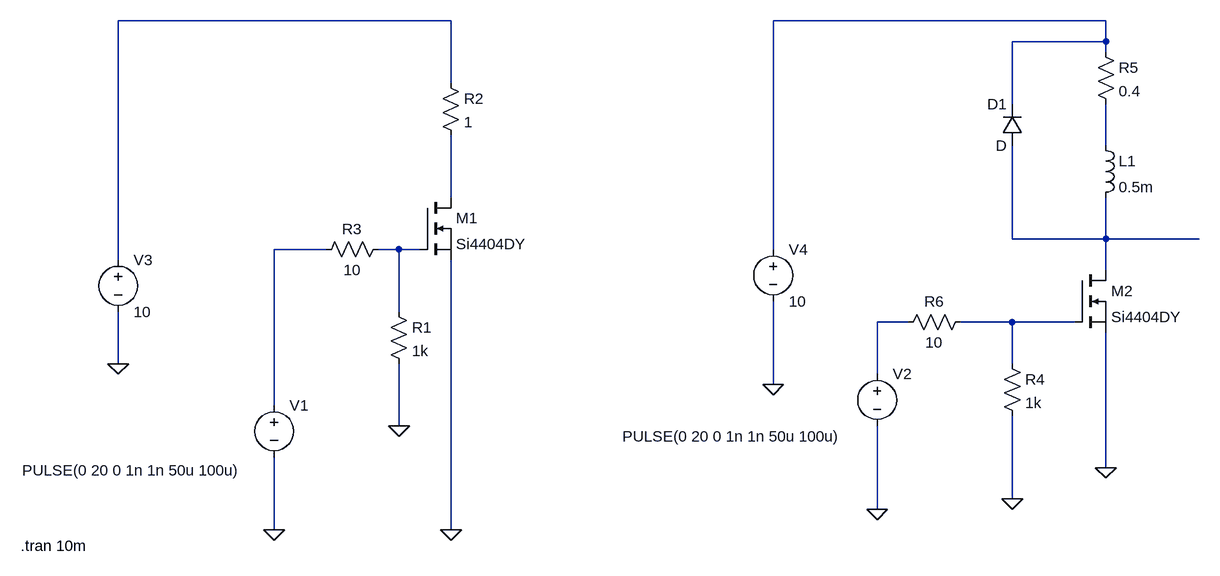
[diagram p0: schematic resistive_Vs_inductive Switching Loss.asc]
resistive_Vs_inductive Switching Loss.asc, the LTspice schematic file:
Version 4
SHEET 1 2072 680
WIRE 512 -320 0 -320
WIRE 1520 -320 1008 -320
WIRE 1520 -288 1520 -320
WIRE 1520 -288 1376 -288
WIRE 1520 -272 1520 -288
WIRE 512 -224 512 -320
WIRE 1376 -192 1376 -288
WIRE 1520 -128 1520 -192
WIRE 512 -48 512 -144
WIRE 1376 16 1376 -128
WIRE 1520 16 1520 -48
WIRE 1520 16 1376 16
WIRE 1664 16 1520 16
WIRE 320 32 240 32
WIRE 432 32 400 32
WIRE 464 32 432 32
WIRE 1008 32 1008 -320
WIRE 0 48 0 -320
WIRE 1520 64 1520 16
WIRE 432 128 432 32
WIRE 1216 144 1168 144
WIRE 1376 144 1296 144
WIRE 1472 144 1376 144
WIRE 0 208 0 128
WIRE 1376 208 1376 144
WIRE 1168 224 1168 144
WIRE 1008 240 1008 112
WIRE 240 272 240 32
WIRE 432 304 432 208
WIRE 1520 368 1520 160
WIRE 1376 416 1376 288
WIRE 1168 432 1168 304
WIRE 240 464 240 352
WIRE 512 464 512 48
FLAG 240 464 0
FLAG 512 464 0
FLAG 0 208 0
FLAG 432 304 0
FLAG 1008 240 0
FLAG 1168 432 0
FLAG 1376 416 0
FLAG 1520 368 0
SYMBOL voltage 240 256 R0
WINDOW 3 -388 116 Left 2
WINDOW 123 0 0 Left 0
WINDOW 39 0 0 Left 0
SYMATTR InstName V1
SYMATTR Value PULSE(0 20 0 1n 1n 50u 100u)
SYMBOL voltage 1168 208 R0
WINDOW 3 -392 112 Left 2
WINDOW 123 0 0 Left 0
WINDOW 39 0 0 Left 0
SYMATTR InstName V2
SYMATTR Value PULSE(0 20 0 1n 1n 50u 100u)
SYMBOL voltage 0 32 R0
WINDOW 123 0 0 Left 0
WINDOW 39 0 0 Left 0
SYMATTR InstName V3
SYMATTR Value 10
SYMBOL voltage 1008 16 R0
WINDOW 123 0 0 Left 0
WINDOW 39 0 0 Left 0
SYMATTR InstName V4
SYMATTR Value 10
SYMBOL res 416 112 R0
SYMATTR InstName R1
SYMATTR Value 1k
SYMBOL res 496 -240 R0
SYMATTR InstName R2
SYMATTR Value 1
SYMBOL res 416 16 R90
WINDOW 0 0 56 VBottom 2
WINDOW 3 32 56 VTop 2
SYMATTR InstName R3
SYMATTR Value 10
SYMBOL ind 1504 -144 R0
SYMATTR InstName L1
SYMATTR Value 0.5m
SYMBOL nmos 464 -48 R0
SYMATTR InstName M1
SYMATTR Value Si4404DY
SYMBOL nmos 1472 64 R0
SYMATTR InstName M2
SYMATTR Value Si4404DY
SYMBOL res 1360 192 R0
SYMATTR InstName R4
SYMATTR Value 1k
SYMBOL res 1504 -288 R0
SYMATTR InstName R5
SYMATTR Value 0.4
SYMBOL res 1312 128 R90
WINDOW 0 0 56 VBottom 2
WINDOW 3 32 56 VTop 2
SYMATTR InstName R6
SYMATTR Value 10
SYMBOL diode 1392 -128 R180
WINDOW 0 24 64 Left 2
WINDOW 3 24 0 Left 2
SYMATTR InstName D1
TEXT -150 488 Left 2 !.tran 10m

The netlist it stands for:
* resistive_Vs_inductive Switching Loss.asc
V1 N006 0 PULSE(0 20 0 1n 1n 50u 100u)
V2 N008 0 PULSE(0 20 0 1n 1n 50u 100u)
V3 N001 0 10
V4 N002 0 10
R1 N007 0 1k
R2 N001 N004 1
R3 N007 N006 10
L1 N003 N005 0.5m
M1 N004 N007 0 0 Si4404DY
M2 N005 N009 0 0 Si4404DY
R4 N009 0 1k
R5 N002 N003 0.4
R6 N009 N008 10
D1 N005 N002 D
.model D D
.lib standard.dio
.model NMOS NMOS
.model PMOS PMOS
.lib standard.mos
.tran 10m
.backanno
.end